# Altium schematic sheet LVL_Shift.SchDoc: Reference Frequency DC Level Shift
size A4; Date: 05.10.2023; ApprovedBy: M.Sc. Tobias Wirth; CheckedBy: M.Sc. Tobias Wirth; Author: M.Sc. Tobias Wirth; CompanyName: University of Stuttgart; DrawnBy: M.Sc. Tobias Wirth; Engineer: M.Sc. Tobias Wirth; Organization: IIS; Address1: Pfaffenwaldring 47; Address2: 70569 Stuttgart; Revision: V1.1; SheetNumber: 10; SheetTotal: 17; ProjectNameAlt: AUS - NMR System; Time: 17:20; ImagePath: N/A; Application_BuildNumber: N/A
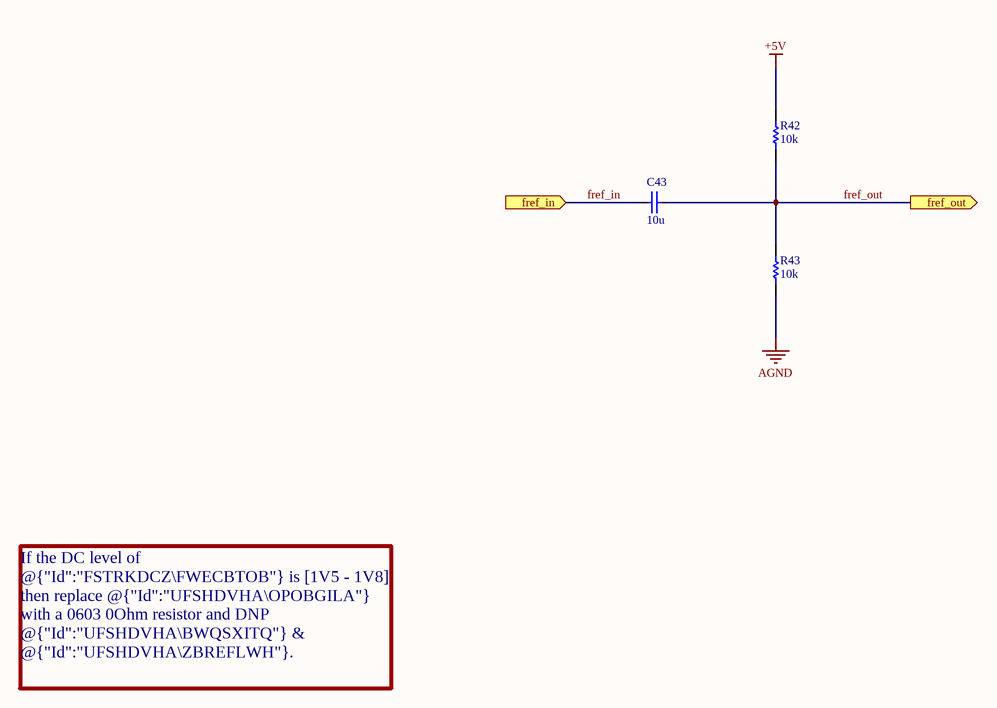
[diagram p0: LVL_Shift.SchDoc]

## Parts
C43  10u  [CAP_0603]
R42  10k  [RES_0603]
R43  10k  [RES_0603]

## Ports
fref_in (in), fref_out (out)

## Nets
+5V: R42.2
AGND: R43.1
fref_in: C43.2 ; port fref_in
fref_out: C43.1 R42.1 R43.2 ; port fref_out

## Notes on the sheet
- If the DC level of @{"Id":"FSTRKDCZ\FWECBTOB"} is [1V5 - 1V8] then replace @{"Id":"UFSHDVHA\OPOBGILA"} with a 0603 0Ohm resistor and DNP @{"Id":"UFSHDVHA\BWQSXITQ"} & @{"Id":"UFSHDVHA\ZBREFLWH"}.
  This is only a fallback / quick and dirty solution. For proper control of AC magnitude and DC level, refer to @{"Id":"JWVSVVKH\STRJVXZL"} on sheet 5.
- Title
- Size
- Date:
- Sheet
- A4
- of
- Project
- Drawn By:
- Revision:

## Library data of the parts
C43 = Cap: Supplier: *; Part Number: *; Value: 10u
R42 R43 = Res: Part Number: *; Supplier: *; Value: 10k